# Altium schematic sheet Stend.SchDoc
size 420 x 297 mm; Address1: Address1; Address2: Address2; Address3: Address3; Address4: Address4; DocumentNumber: ИУ4.11.03.03.25.06.62.14.003 Э1; SheetNumber: 4; SheetTotal: 4; DocumentType: Структурная схема измерительного стенда; FirstReferrence: ИУ4.11.03.03.25.06.62.14.001
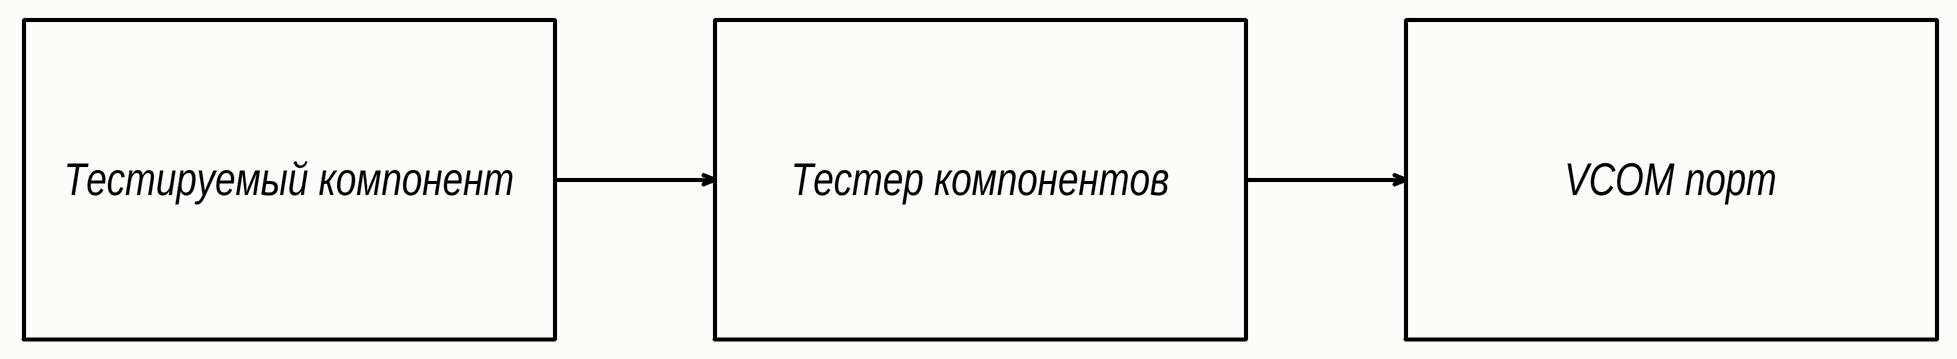
[diagram p0: Stend.SchDoc]

## Notes on the sheet
- Тестируемый компонент
- Тестер компонентов
- VCOM порт
- Перв. примен.
- Справ. №
- Подп. и дата
- Инв. № дубл.
- Взам. инв. №
- Разраб.
- Изм.
- Лист
- № докум.
- Подп.
- Дата
- Лит.
- Масса
- Масштаб
- Пров.
- Т.контр.
- Листов
- 1
- Инв. № подл.
- Утв.
- Н.контр.
- Кафедра ИУ4
- МГТУ им. Н. Э. Баумана
- 2.106-A3
- Копировал
- Формат А3
- Группа ИУ4-62Б